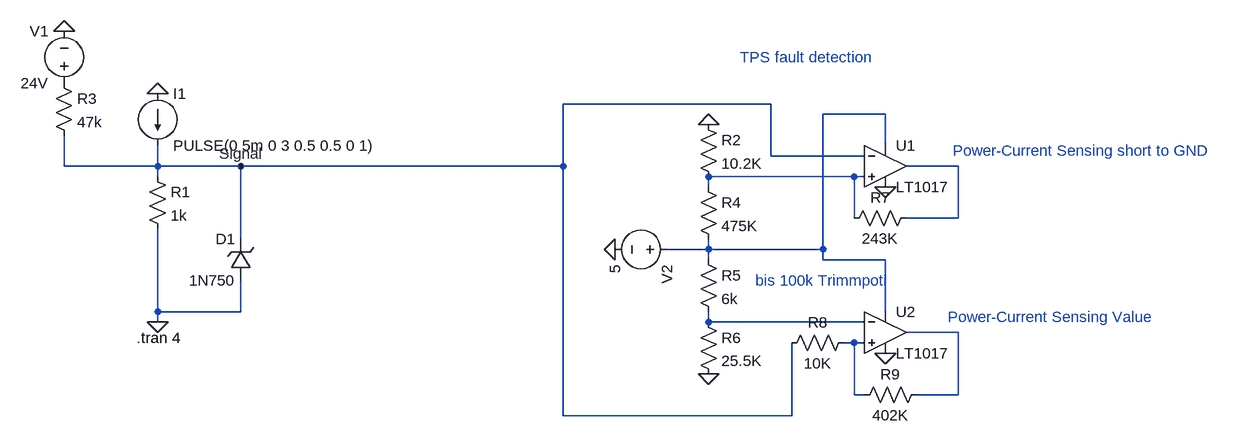
[diagram p0: schematic Sensorboard_Sim.asc]
Sensorboard_Sim.asc, the LTspice schematic file:
Version 4
SHEET 1 1812 680
WIRE 1104 80 784 80
WIRE 1280 96 1184 96
WIRE 1280 144 1280 96
WIRE 1104 160 1104 80
WIRE 1248 160 1104 160
WIRE 16 176 16 128
WIRE 160 176 160 144
WIRE 160 176 16 176
WIRE 288 176 160 176
WIRE 784 176 784 80
WIRE 784 176 288 176
WIRE 1392 176 1312 176
WIRE 160 192 160 176
WIRE 1232 192 1008 192
WIRE 1248 192 1232 192
WIRE 1008 208 1008 192
WIRE 1232 256 1232 192
WIRE 1392 256 1392 176
WIRE 1392 256 1312 256
WIRE 288 288 288 176
WIRE 1008 304 1008 288
WIRE 1008 304 944 304
WIRE 1184 304 1184 96
WIRE 1184 304 1008 304
WIRE 1008 320 1008 304
WIRE 1184 320 1184 304
WIRE 1280 320 1184 320
WIRE 160 400 160 272
WIRE 288 400 288 352
WIRE 288 400 160 400
WIRE 1280 400 1280 320
WIRE 160 416 160 400
WIRE 1008 416 1008 400
WIRE 1248 416 1008 416
WIRE 1392 432 1312 432
WIRE 1232 448 1216 448
WIRE 1248 448 1232 448
WIRE 1232 528 1232 448
WIRE 1248 528 1232 528
WIRE 1392 528 1392 432
WIRE 1392 528 1328 528
WIRE 784 560 784 176
WIRE 1136 560 1136 448
WIRE 1136 560 784 560
FLAG 160 416 0
FLAG 160 64 0
FLAG 288 176 Signal
FLAG 16 -32 0
FLAG 1008 112 0
FLAG 1008 496 0
FLAG 864 304 0
FLAG 1280 208 0
FLAG 1280 464 0
SYMBOL current 160 64 R0
WINDOW 123 0 0 Left 0
WINDOW 39 0 0 Left 0
SYMATTR InstName I1
SYMATTR Value PULSE(0 5m 0 3 0.5 0.5 0 1)
SYMBOL res 144 176 R0
SYMATTR InstName R1
SYMATTR Value 1k
SYMBOL zener 304 352 R180
WINDOW 0 24 64 Left 2
WINDOW 3 24 0 Left 2
SYMATTR InstName D1
SYMATTR Value 1N750
SYMATTR Description Diode
SYMATTR Type diode
SYMBOL res 0 32 R0
SYMATTR InstName R3
SYMATTR Value 47k
SYMBOL voltage 16 64 R180
WINDOW 0 24 96 Left 2
WINDOW 3 24 16 Left 2
WINDOW 123 0 0 Left 0
WINDOW 39 0 0 Left 0
SYMATTR InstName V1
SYMATTR Value 24V
SYMBOL res 992 96 R0
SYMATTR InstName R2
SYMATTR Value 10.2K
SYMATTR SpiceLine tol=1 pwr=0.1
SYMBOL res 992 192 R0
SYMATTR InstName R4
SYMATTR Value 475K
SYMATTR SpiceLine tol=1 pwr=0.1
SYMBOL res 992 304 R0
SYMATTR InstName R5
SYMATTR Value 6k
SYMATTR SpiceLine tol=1 pwr=0.1
SYMBOL res 992 400 R0
SYMATTR InstName R6
SYMATTR Value 25.5K
SYMATTR SpiceLine tol=1 pwr=0.1
SYMBOL Comparators\\LT1017 1280 176 R0
SYMATTR InstName U1
SYMBOL Comparators\\LT1017 1280 432 R0
SYMATTR InstName U2
SYMBOL res 1328 240 R90
WINDOW 0 0 56 VBottom 2
WINDOW 3 32 56 VTop 2
SYMATTR InstName R7
SYMATTR Value 243K
SYMATTR SpiceLine tol=1 pwr=0.1
SYMBOL res 1232 432 R90
WINDOW 0 0 56 VBottom 2
WINDOW 3 32 56 VTop 2
SYMATTR InstName R8
SYMATTR Value 10K
SYMATTR SpiceLine tol=1 pwr=0.1
SYMBOL res 1344 512 R90
WINDOW 0 0 56 VBottom 2
WINDOW 3 32 56 VTop 2
SYMATTR InstName R9
SYMATTR Value 402K
SYMATTR SpiceLine tol=1 pwr=0.1
SYMBOL voltage 960 304 R90
WINDOW 123 0 0 Left 0
WINDOW 39 0 0 Left 0
SYMATTR InstName V2
SYMATTR Value 5
TEXT 128 440 Left 2 !.tran 4
TEXT 1056 8 Left 2 ;TPS fault detection
TEXT 1080 352 Left 2 ;bis 100k Trimmpoti
TEXT 1376 408 Left 2 ;Power-Current Sensing Value
TEXT 1384 152 Left 2 ;Power-Current Sensing short to GND

The netlist it stands for:
* Sensorboard_Sim.asc
I1 0 Signal PULSE(0 5m 0 3 0.5 0.5 0 1)
R1 Signal 0 1k
D1 0 Signal 1N750
R3 P001 Signal 47k
V1 P001 0 24V
R2 0 N003 10.2K tol=1 pwr=0.1
R4 N003 N001 475K tol=1 pwr=0.1
R5 N001 N004 6k tol=1 pwr=0.1
R6 N004 0 25.5K tol=1 pwr=0.1
XU1 N003 Signal N001 0 N002 LT1017  ; pins In+ In- V+ V- OUT
XU2 N006 N004 N001 0 N005 LT1017  ; pins In+ In- V+ V- OUT
R7 N002 N003 243K tol=1 pwr=0.1
R8 N006 Signal 10K tol=1 pwr=0.1
R9 N005 N006 402K tol=1 pwr=0.1
V2 N001 0 5
.model D D
.lib standard.dio
.tran 4
* TPS fault detection
* bis 100k Trimmpoti
* Power-Current Sensing Value
* Power-Current Sensing short to GND
.backanno
.end